# EAGLE schematic MineralFire (EAGLE 8.3.2)
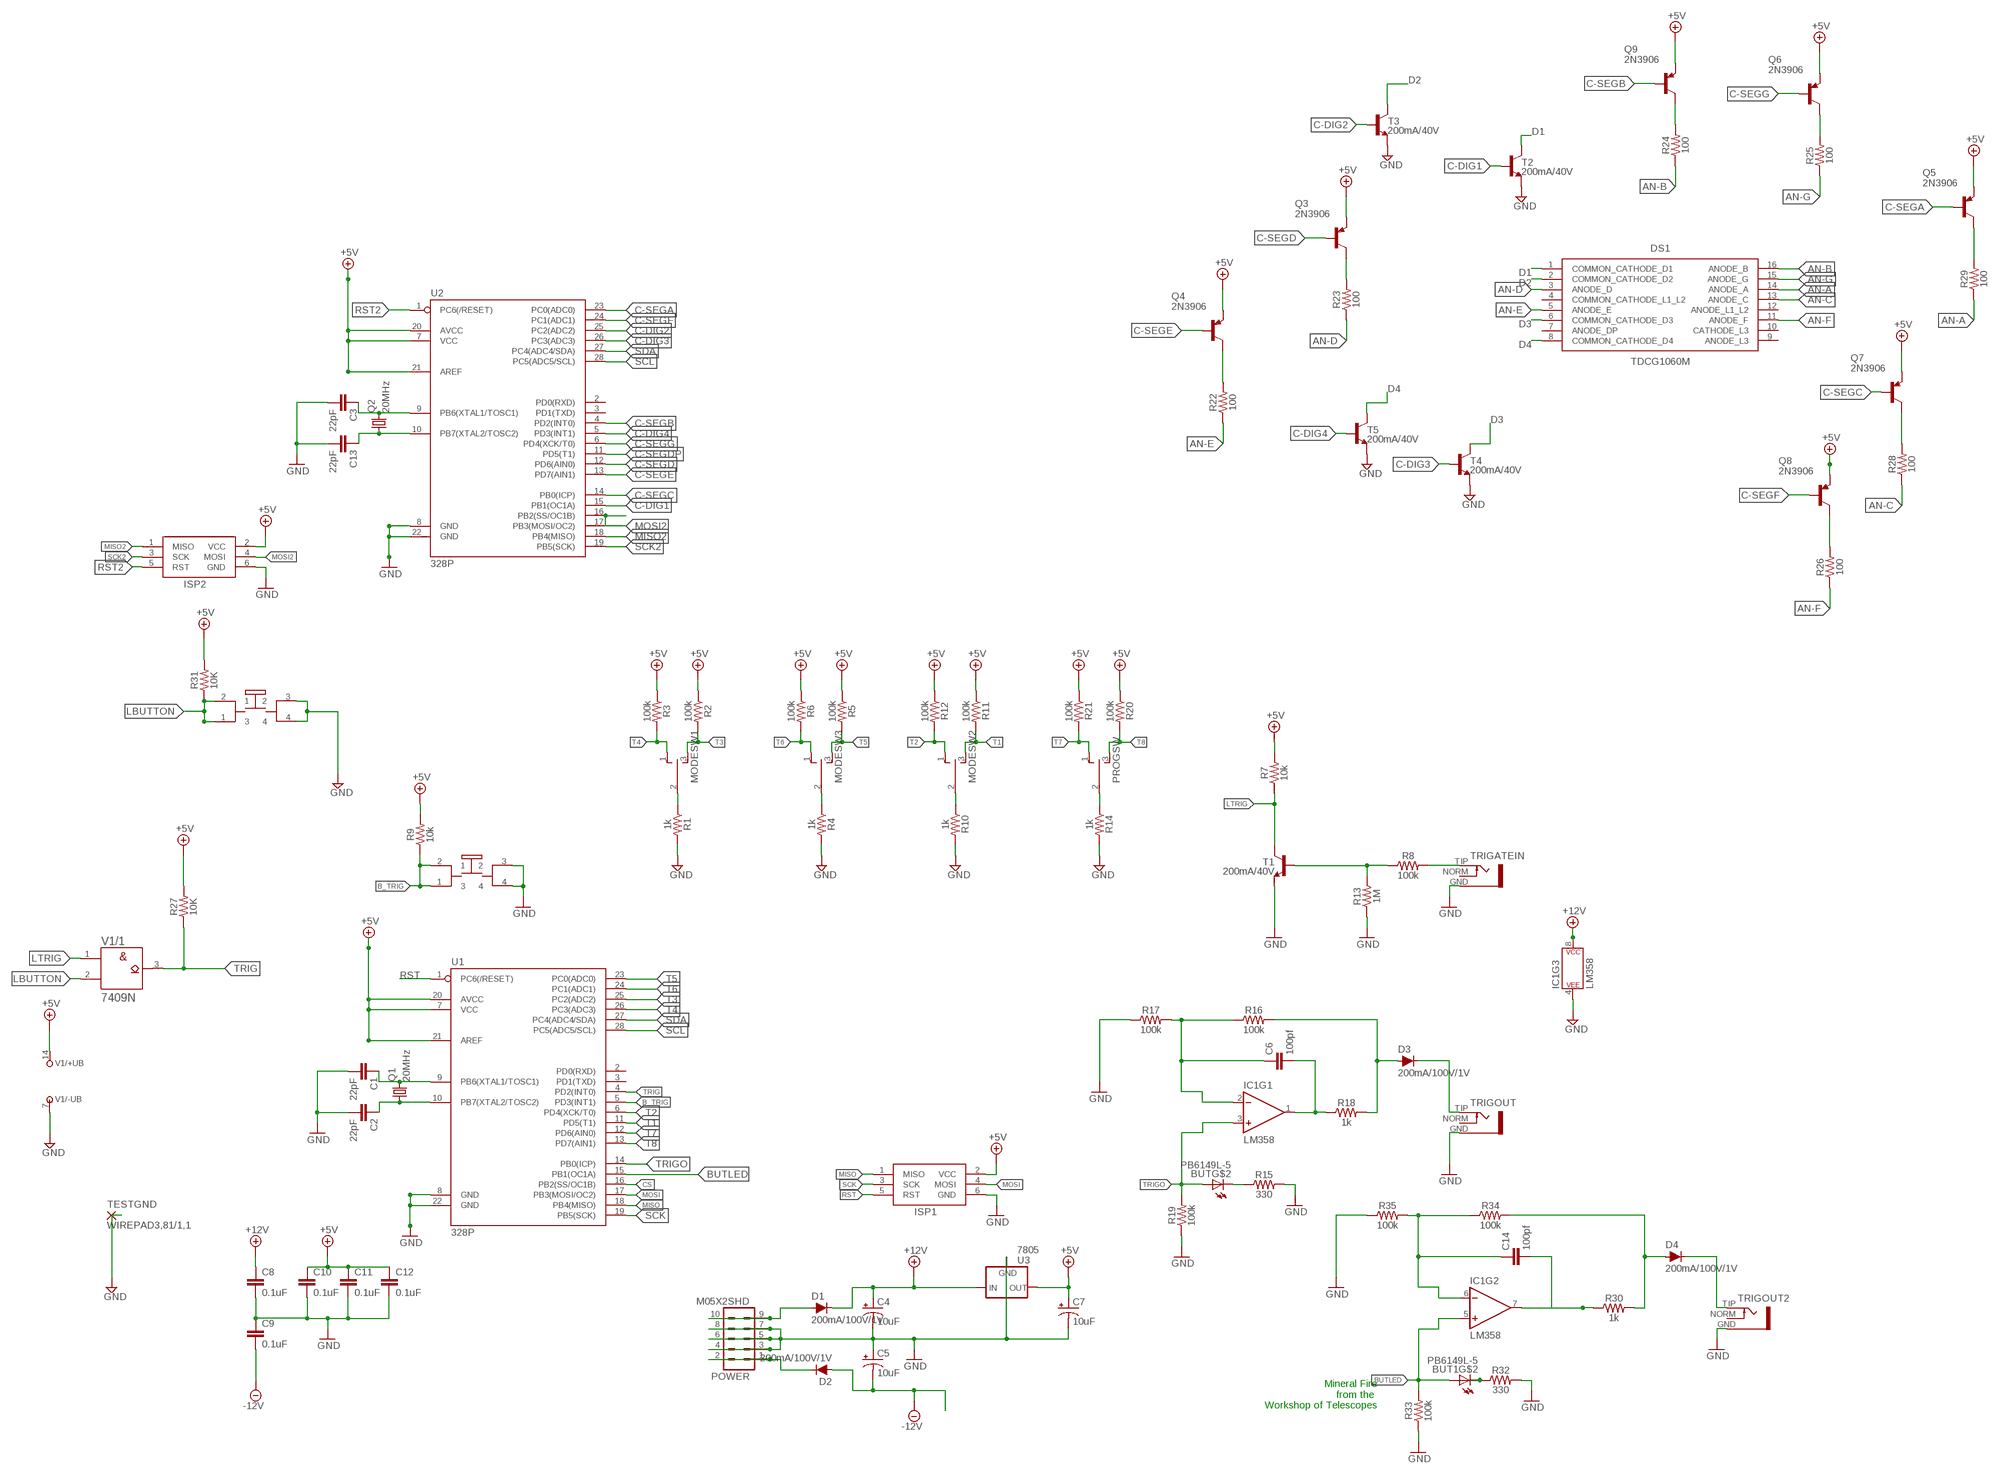
[diagram p0: schematic, sheet 1]

## Parts
BUT  PB6149L-5  [PB6149L]
BUT1  PB6149L-5  [PB6149L]
C1  22pF  22PF-PTH-2.54MM-200V-5%  [CAP-PTH-2.54]
C2  22pF  22PF-PTH-2.54MM-200V-5%  [CAP-PTH-2.54]
C3  22pF  22PF-PTH-2.54MM-200V-5%  [CAP-PTH-2.54]
C4  10uF  10UF-POLAR-RADIAL-2.5MM-25V-20%  [CPOL-RADIAL-2.5MM-5MM]
C5  10uF  10UF-POLAR-RADIAL-2.5MM-25V-20%  [CPOL-RADIAL-2.5MM-5MM]
C6  100pf  C-EU075-032X103  [C075-032X103]
C7  10uF  10UF-POLAR-RADIAL-2.5MM-25V-20%  [CPOL-RADIAL-2.5MM-5MM]
C8  0.1uF  0.1UF-KIT-EZ-50V-20%  [CAP-PTH-SMALL-KIT]
C9  0.1uF  0.1UF-KIT-EZ-50V-20%  [CAP-PTH-SMALL-KIT]
C10  0.1uF  0.1UF-KIT-EZ-50V-20%  [CAP-PTH-SMALL-KIT]
C11  0.1uF  0.1UF-KIT-EZ-50V-20%  [CAP-PTH-SMALL-KIT]
C12  0.1uF  0.1UF-KIT-EZ-50V-20%  [CAP-PTH-SMALL-KIT]
C13  22pF  22PF-PTH-2.54MM-200V-5%  [CAP-PTH-2.54]
C14  100pf  C-EU075-032X103  [C075-032X103]
D1  200mA/100V/1V  DIODE-1N4148  [DIODE-1N4148]
D2  200mA/100V/1V  DIODE-1N4148  [DIODE-1N4148]
D3  200mA/100V/1V  DIODE-1N4148  [DIODE-1N4148]
D4  200mA/100V/1V  DIODE-1N4148  [DIODE-1N4148]
DS1  TDCG1060M  [DIPS1016W50P254L4020H700Q16N]
IC1  LM358  [DIP08]
ISP1  AVRISP-6  [AVRISP]
ISP2  AVRISP-6  [AVRISP]
MODESW1  TOGGLE_ON_OFF_ON  [TOGGLE_ON_OFF_ON]
MODESW2  TOGGLE_ON_OFF_ON  [TOGGLE_ON_OFF_ON]
MODESW3  TOGGLE_ON_OFF_ON  [TOGGLE_ON_OFF_ON]
POWER  M05X2SHD  [2X5-SHROUDED]
PROGSW  TOGGLE_ON_OFF_ON  [TOGGLE_ON_OFF_ON]
Q1  20MHz  CRYSTALHC49U70  [HC49U70]
Q2  20MHz  CRYSTALHC49U70  [HC49U70]
Q3  2N3906  [TO92]
Q4  2N3906  [TO92]
Q5  2N3906  [TO92]
Q6  2N3906  [TO92]
Q7  2N3906  [TO92]
Q8  2N3906  [TO92]
Q9  2N3906  [TO92]
R1  1k  1KOHM-HORIZ-1/4W-5%  [AXIAL-0.3]
R2  100k  100KOHM-HORIZ-1/4W-5%  [AXIAL-0.3]
R3  100k  100KOHM-HORIZ-1/4W-5%  [AXIAL-0.3]
R4  1k  1KOHM-HORIZ-1/4W-5%  [AXIAL-0.3]
R5  100k  100KOHM-HORIZ-1/4W-5%  [AXIAL-0.3]
R6  100k  100KOHM-HORIZ-1/4W-5%  [AXIAL-0.3]
R7  10k  10KOHM-HORIZ-1/4W-5%  [AXIAL-0.3]
R8  100k  100KOHM-HORIZ-1/4W-5%  [AXIAL-0.3]
R9  10k  10KOHM-HORIZ-1/4W-1%  [AXIAL-0.3]
R10  1k  1KOHM-HORIZ-1/4W-5%  [AXIAL-0.3]
R11  100k  100KOHM-HORIZ-1/4W-5%  [AXIAL-0.3]
R12  100k  100KOHM-HORIZ-1/4W-5%  [AXIAL-0.3]
R13  1M  1MOHM-HORIZ-1/4W-5%  [AXIAL-0.3]
R14  1k  1KOHM-HORIZ-1/4W-5%  [AXIAL-0.3]
R15  330  330OHM-HORIZ-1/10W-5%  [AXIAL-0.3]
R16  100k  100KOHM-HORIZ-1/4W-5%  [AXIAL-0.3]
R17  100k  100KOHM-HORIZ-1/4W-5%  [AXIAL-0.3]
R18  1k  1KOHM-HORIZ-1/4W-5%  [AXIAL-0.3]
R19  100k  100KOHM-HORIZ-1/4W-5%  [AXIAL-0.3]
R20  100k  100KOHM-HORIZ-1/4W-5%  [AXIAL-0.3]
R21  100k  100KOHM-HORIZ-1/4W-5%  [AXIAL-0.3]
R22  100  100OHM-HORIZ_KIT-1/4W-1%  [AXIAL-0.3EZ]
R23  100  100OHM-HORIZ_KIT-1/4W-1%  [AXIAL-0.3EZ]
R24  100  100OHM-HORIZ_KIT-1/4W-1%  [AXIAL-0.3EZ]
R25  100  100OHM-HORIZ_KIT-1/4W-1%  [AXIAL-0.3EZ]
R26  100  100OHM-HORIZ_KIT-1/4W-1%  [AXIAL-0.3EZ]
R27  10K  100OHM-HORIZ_KIT-1/4W-1%  [AXIAL-0.3EZ]
R28  100  100OHM-HORIZ_KIT-1/4W-1%  [AXIAL-0.3EZ]
R29  100  100OHM-HORIZ_KIT-1/4W-1%  [AXIAL-0.3EZ]
R30  1k  1KOHM-HORIZ-1/4W-5%  [AXIAL-0.3]
R31  10K  100OHM-HORIZ_KIT-1/4W-1%  [AXIAL-0.3EZ]
R32  330  330OHM-HORIZ-1/10W-5%  [AXIAL-0.3]
R33  100k  100KOHM-HORIZ-1/4W-5%  [AXIAL-0.3]
R34  100k  100KOHM-HORIZ-1/4W-5%  [AXIAL-0.3]
R35  100k  100KOHM-HORIZ-1/4W-5%  [AXIAL-0.3]
T1  200mA/40V  TRANS_NPN-2N3904  [TO-92]
T2  200mA/40V  TRANS_NPN-2N3904  [TO-92]
T3  200mA/40V  TRANS_NPN-2N3904  [TO-92]
T4  200mA/40V  TRANS_NPN-2N3904  [TO-92]
T5  200mA/40V  TRANS_NPN-2N3904  [TO-92]
TESTGND  WIREPAD3,81/1,1  [3,81/1,1]
TRIGATEIN  S_JACK  [S_JACK]
TRIGOUT  S_JACK  [S_JACK]
TRIGOUT2  S_JACK  [S_JACK]
U1  328P  ATMEGA328P_PDIP  [DIP28]
U2  328P  ATMEGA328P_PDIP  [DIP28]
U3  7805  V_REG_78XX-TO-220  [TO-220-ALT]
V1  7409N  [DIL14]

## Nets
+5V [Power]: C7.1(+) C10.1 C11.1 C12.1 ISP1.2(VCC) ISP2.2(VCC) Q3.3(E) Q4.3(E) Q5.3(E) Q6.3(E) Q7.3(E) Q8.3(E) Q9.3(E) R2.P$1 R3.P$1 R5.P$1 R6.P$1 R7.P$2 R9.P$2 R11.P$1 R12.P$1 R20.P$1 R21.P$1 R27.P$2 R31.P$2 U1.7(VCC) U1.20(AVCC) U1.21(AREF) U2.7(VCC) U2.20(AVCC) U2.21(AREF) U3.OUT V1.14(/+UB:+UB)
+12V [Power]: C4.1(+) C8.1 D1.C IC1.8(P$V+) U3.IN
-12V [Power]: C5.2(-) C9.2 D2.A
AN-A: DS1.14(ANODE_A) R29.P$1
AN-B: DS1.16(ANODE_B) R24.P$1
AN-C: DS1.13(ANODE_C) R28.P$1
AN-D: DS1.3(ANODE_D) R23.P$1
AN-E: DS1.5(ANODE_E) R22.P$1
AN-F: DS1.11(ANODE_F) R26.P$1
AN-G: DS1.15(ANODE_G) R25.P$1
B_TRIG: BUT.1 BUT.2 R9.P$1 U1.5(PD3(INT1))
BUTLED: BUT1.A IC1.5(+IN) R33.P$2 U1.15(PB1(OC1A))
C-DIG1: T2.2(B) U2.15(PB1(OC1A))
C-DIG2: T3.2(B) U2.25(PC2(ADC2))
C-DIG3: T4.2(B) U2.26(PC3(ADC3))
C-DIG4: T5.2(B) U2.5(PD3(INT1))
C-SEGA: Q5.2(B) U2.23(PC0(ADC0))
C-SEGB: Q9.2(B) U2.4(PD2(INT0))
C-SEGC: Q7.2(B) U2.14(PB0(ICP))
C-SEGD: Q3.2(B) U2.12(PD6(AIN0))
C-SEGDP: U2.11(PD5(T1))
C-SEGE: Q4.2(B) U2.13(PD7(AIN1))
C-SEGF: Q8.2(B) U2.24(PC1(ADC1))
C-SEGG: Q6.2(B) U2.6(PD4(XCK/T0))
CS: U1.16(PB2(SS/OC1B))
D1: DS1.1(COMMON_CATHODE_D1) T2.3(C)
D2: DS1.2(COMMON_CATHODE_D2) T3.3(C)
D3: DS1.6(COMMON_CATHODE_D3) T4.3(C)
D4: DS1.8(COMMON_CATHODE_D4) T5.3(C)
GND [Power]: BUT1.3 BUT1.4 BUT.3 BUT.4 C1.2 C2.2 C3.2 C4.2(-) C5.1(+) C7.2(-) C8.2 C9.1 C10.2 C11.2 C12.2 C13.2 IC1.4(P$V-) ISP1.6(GND) ISP2.6(GND) POWER.3 POWER.4 POWER.5 POWER.6 POWER.7 POWER.8 R1.P$2 R4.P$2 R10.P$2 R13.P$1 R14.P$2 R15.P$2 R17.P$1 R19.P$1 R32.P$2 R33.P$1 R35.P$1 T1.1(E) T2.1(E) T3.1(E) T4.1(E) T5.1(E) TESTGND.1(P) TRIGATEIN.GND TRIGOUT2.GND TRIGOUT.GND U1.8(GND) U1.22(GND) U2.8(GND) U2.22(GND) U3.GND V1.7(/-UB:-UB)
LBUTTON [Power]: BUT1.1 BUT1.2 R31.P$1 V1.2(/1:B)
LTRIG: R7.P$1 T1.3(C) V1.1(/1:A)
MISO: ISP1.1(MISO) U1.18(PB4(MISO))
MISO2: ISP2.1(MISO) U2.18(PB4(MISO))
MOSI: ISP1.4(MOSI) U1.17(PB3(MOSI/OC2))
MOSI2: ISP2.4(MOSI) U2.16(PB2(SS/OC1B)) U2.17(PB3(MOSI/OC2))
N$1: C1.1 Q1.2 U1.9(PB6(XTAL1/TOSC1))
N$2: C2.1 Q1.1 U1.10(PB7(XTAL2/TOSC2))
N$3: MODESW1.2(P) R1.P$1
N$4: MODESW3.2(P) R4.P$1
N$5: Q4.1(C) R22.P$2
N$6: PROGSW.2(P) R14.P$1
N$7: C3.1 Q2.2 U2.9(PB6(XTAL1/TOSC1))
N$8: C13.1 Q2.1 U2.10(PB7(XTAL2/TOSC2))
N$9: D1.A POWER.9 POWER.10
N$10: D2.C POWER.1 POWER.2
N$11: Q3.1(C) R23.P$2
N$12: MODESW2.2(P) R10.P$1
N$13: Q9.1(C) R24.P$2
N$14: Q8.1(C) R26.P$2
N$15: R8.P$1 R13.P$2 T1.2(B)
N$16: Q7.1(C) R28.P$2
N$17: Q6.1(C) R25.P$2
N$18: R8.P$2 TRIGATEIN.TIP
N$19: IC1.7(OUT) R30.P$1
N$20: Q5.1(C) R29.P$2
N$21: BUT1.K(C) R32.P$1
N$22: D4.A R30.P$2
N$23: D4.C TRIGOUT2.TIP
N$24: C14.1 IC1.6(-IN) R34.P$1 R35.P$2
N$25: C14.2
N$26: R34.P$2
N$31: BUT.K(C) R15.P$1
N$32: C6.1 IC1.2(-IN) R16.P$1 R17.P$2
N$33: C6.2 IC1.1(OUT) R18.P$1
N$34: D3.A R16.P$2 R18.P$2
N$74: D3.C TRIGOUT.TIP
RST: ISP1.5(RST) U1.1(PC6(/RESET))
RST2: ISP2.5(RST) U2.1(PC6(/RESET))
SCK: ISP1.3(SCK) U1.19(PB5(SCK))
SCK2: ISP2.3(SCK) U2.19(PB5(SCK))
SCL: U1.28(PC5(ADC5/SCL)) U2.28(PC5(ADC5/SCL))
SDA: U1.27(PC4(ADC4/SDA)) U2.27(PC4(ADC4/SDA))
T1: MODESW2.3(S) R11.P$2 U1.11(PD5(T1))
T2: MODESW2.1(O) R12.P$2 U1.6(PD4(XCK/T0))
T3: MODESW1.3(S) R2.P$2 U1.25(PC2(ADC2))
T4: MODESW1.1(O) R3.P$2 U1.26(PC3(ADC3))
T5: MODESW3.3(S) R5.P$2 U1.23(PC0(ADC0))
T6: MODESW3.1(O) R6.P$2 U1.24(PC1(ADC1))
T7: PROGSW.1(O) R21.P$2 U1.12(PD6(AIN0))
T8: PROGSW.3(S) R20.P$2 U1.13(PD7(AIN1))
TRIG: R27.P$1 U1.4(PD2(INT0)) V1.3(/1:Y)
TRIGO: BUT.A IC1.3(+IN) R19.P$2 U1.14(PB0(ICP))
Unconnected: DS1.4(COMMON_CATHODE_L1_L2) DS1.7(ANODE_DP) DS1.9(ANODE_L3) DS1.10(CATHODE_L3) DS1.12(ANODE_L1_L2) TRIGATEIN.NORM TRIGOUT2.NORM TRIGOUT.NORM U1.2(PD0(RXD)) U1.3(PD1(TXD)) U2.2(PD0(RXD)) U2.3(PD1(TXD)) V1.4(/2:A) V1.5(/2:B) V1.6(/2:Y) V1.8(/3:Y) V1.9(/3:A) V1.10(/3:B) V1.11(/4:Y) V1.12(/4:A) V1.13(/4:B)

## Notes on the sheet
- Mineral Fire
  from the 
  Workshop of Telescopes

## Library data of the parts
BUT BUT1 = INSTRUO:PB6149L-5
C1-C3 C13 = SparkFun-Capacitors:22PF: 22pF ceramic capacitors A capacitor is a passive two-terminal electrical component used to store electrical energy temporarily in an electric field.; PROD_ID: CAP-09128
C4 C5 C7 = SparkFun-Capacitors:10UF-POLAR: 10.0µF polarized capacitors A capacitor is a passive two-terminal electrical component used to store electrical energy temporarily in an electric field.; PROD_ID: CAP-08440
C6 C14 = rcl:C-EU: CAPACITOR, European symbol
C8-C12 = SparkFun-Capacitors:0.1UF: 0.1µF ceramic capacitors A capacitor is a passive two-terminal electrical component used to store electrical energy temporarily in an electric field.; PROD_ID: CAP-08370
D1-D4 = SparkFun-DiscreteSemi:DIODE: Diode These are standard reverse protection diodes and small signal diodes. SparkFun Products: SparkFun SparkPunk Sound Kit <https://www.sparkfun.com/products/11177> SparkFun ESP8266 Thing <https://www.sparkfun.com/products/13231>; PROD_ID: DIO-08378
DS1 = TDCG1060M:TDCG1060M: VISHAY - TDCG1060M - DISPLAY, SEVEN SEGMENT, 10MM, GREEN <https://componentsearchengine.com/Images/1/TDCG1060M.jpg> Source: Datasheet <http://www.mouser.com/ds/2/427/tdc10m-88849.pdf>; DESCRIPTION: VISHAY - TDCG1060M - DISPLAY, SEVEN SEGMENT, 10MM, GREEN; HEIGHT: 7mm; MANUFACTURER_NAME: Vishay; MANUFACTURER_PART_NUMBER: TDCG1060M; RS_PART_NUMBER: 8187530P; SUPPLIER_NAME: RS
IC1 = SparkFun-IC-Amplifiers:LM358: LM358 Jellybean op-amp Datasheet <http://www.sparkfun.com/datasheets/Components/General/LM358.pdf> SparkFun Products Op-Amp (Thru-Hole) - LM358 <https://www.sparkfun.com/products/9456> (COM-09456); PROD_ID: IC-09172
ISP1 ISP2 = adafruit:AVRISP: AVR ISP HEADER Standard 6 pin header for AVR programming
MODESW1-MODESW3 PROGSW = INSTRUO:TOGGLE_ON_OFF_ON
POWER = SparkFun-Connectors:M05X2: Header 5x2 Standard 10-pin dual row 0.1" header. Commonly used with AVR-ISP. Use with Spark Fun Electronics SKU: PRT-00778
Q1 Q2 = adafruit:CRYSTAL: CRYSTAL; OC_FARNELL: unknown; OC_NEWARK: unknown
Q3-Q9 = transistor-pnp:2N3906: PNP Transistor
R1 R4 R10 R14 R18 R30 = SparkFun-Resistors:1KOHM: 1kΩ resistor A resistor is a passive two-terminal electrical component that implements electrical resistance as a circuit element. Resistors act to reduce current flow, and, at the same time, act to lower voltage levels within circuits. - Wikipedia; PROD_ID: RES-08380
R2 R3 R5 R6 R8 R11 R12 R16 R17 R19-R21 R33-R35 = SparkFun-Resistors:100KOHM: 100kΩ resistor A resistor is a passive two-terminal electrical component that implements electrical resistance as a circuit element. Resistors act to reduce current flow, and, at the same time, act to lower voltage levels within circuits. - Wikipedia; PROD_ID: RES-10686
R7 = SparkFun-Resistors:10KOHM: 10kΩ resistor A resistor is a passive two-terminal electrical component that implements electrical resistance as a circuit element. Resistors act to reduce current flow, and, at the same time, act to lower voltage levels within circuits. - Wikipedia; PROD_ID: RES-09435
R9 = SparkFun-Resistors:10KOHM: 10kΩ resistor A resistor is a passive two-terminal electrical component that implements electrical resistance as a circuit element. Resistors act to reduce current flow, and, at the same time, act to lower voltage levels within circuits. - Wikipedia; PROD_ID: RES-12183
R13 = SparkFun-Resistors:1MOHM: 1MΩ resistor A resistor is a passive two-terminal electrical component that implements electrical resistance as a circuit element. Resistors act to reduce current flow, and, at the same time, act to lower voltage levels within circuits. - Wikipedia; PROD_ID: RES-09329
R15 R32 = SparkFun-Resistors:330OHM: 330Ω resistor A resistor is a passive two-terminal electrical component that implements electrical resistance as a circuit element. Resistors act to reduce current flow, and, at the same time, act to lower voltage levels within circuits. - Wikipedia; PROD_ID: RES-8371
R22-R26 R28 R29 = SparkFun-Resistors:100OHM: 100Ω resistor A resistor is a passive two-terminal electrical component that implements electrical resistance as a circuit element. Resistors act to reduce current flow, and, at the same time, act to lower voltage levels within circuits. - Wikipedia; PROD_ID: RES-12181
R27 R31 = SparkFun-Resistors:100OHM: 100Ω resistor A resistor is a passive two-terminal electrical component that implements electrical resistance as a circuit element. Resistors act to reduce current flow, and, at the same time, act to lower voltage levels within circuits. - Wikipedia; PROD_ID: RES-12181; VALUE: 100
T1-T5 = SparkFun-DiscreteSemi:TRANS_NPN: NPN transistor Current controlled devices typically used to amplify current or used as a switch. BC547 - COM-08928 <http://www.sparkfun.com/products/8928> (TO-92 45V 100mA) (1.Collector 2.Base 3.Emitter) 2N3904 - COM-00521 <http://www.sparkfun.com/products/521> (TO-92 40V 200mA) (1.Emitter 2.Base 3.Collector) P2N2222A - COM-12852 <http://www.sparkfun.com/products/12852> (TO-92 40V 600mA) (1.Collector 2.Base 3.Emitter); PROD_ID: TRANS-08447
TESTGND = wirepad:WIREPAD: Wire PAD connect wire on PCB
TRIGATEIN TRIGOUT TRIGOUT2 = INSTRUO:S_JACK
U1 U2 = SparkFun-IC-Microcontroller:ATMEGA328P_PDIP: Atmel 328P Through hole ATMEGA328P uC used in the Arduino 32kb flash, 1k EEPROM, 2k SRAM Datasheet <http://www.sparkfun.com/datasheets/Components/SMD/ATMega328.pdf> SparkFun Products Storefront component: AVR 28 Pin 20MHz 32K 6A/D - ATMega328P <https://www.sparkfun.com/products/9061> (COM-09061) SparkFun Simon Says - Through-Hole Soldering Kit <https://www.sparkfun.com/products/10547> (KIT-10547) SparkFun Learn to Solder - Simon Says <https://www.sparkfun.com/products/13708> (KIT-13708) SparkFun BigTime Watch Kit <https://www.sparkfun.com/products/11734> (KIT-11734) SparkFun ClockIt <https://www.sparkfun.com/products/10930> (KIT-10930) SparkFun Serial Enabled LCD Kit <https://www.sparkfun.com/products/10097> (LCD-10097) SparkFun Simon Tilts - Through Hole Soldering Kit <https://www.sparkfun.com/products/12634> (KIT-12634) SparkFun Frequency Counter Kit <https://www.sparkfun.com/products/10140> (KIT-10140) FabFM Radio Kit <https://www.sparkfun.com/products/11043> (KIT-11043) SparkFun Binary Blaster Kit <https://www.sparkfun.com/products/12037> (KIT-12037) SparkFun Metro-Gnome <https://www.sparkfun.com/products/9236> (KIT-09236) ATmega328 with Arduino Optiboot (Uno) <https://www.sparkfun.com/products/10524> (DEV-10524); PROD_ID: IC-09136
U3 = SparkFun-IC-Power:V_REG_78XX: Voltage Regulator Standard 78xx regulator. IGO (Input Ground Output). Spark Fun Electronics SKU : COM-00107; PROD_ID: VREG-08450; SF_ID: COM-00107
V1 = 74ttl-din:74*09: Quad 2-input AND gate, open collector

## Net classes
1 Power: width 0.8 mm